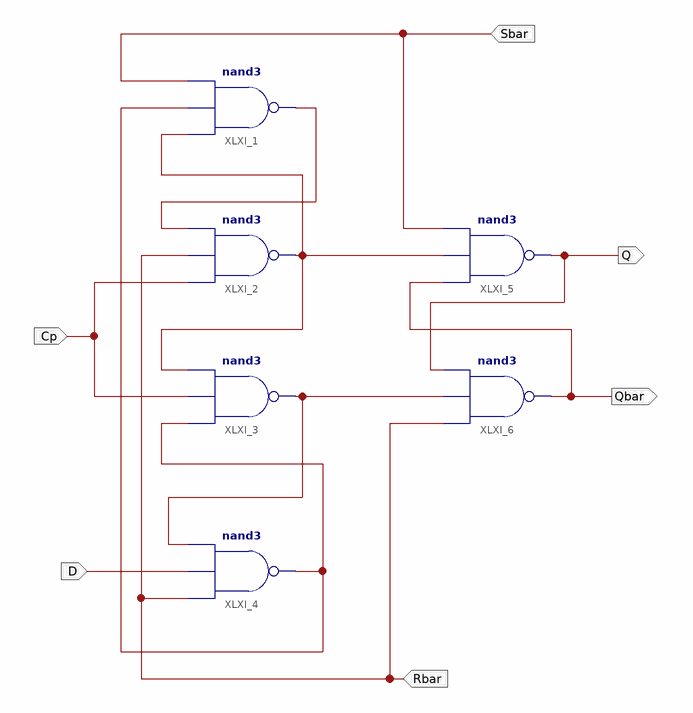
[diagram p0: schematic sheet 1]
// Xilinx ISE schematic D_FLIPFLOP.sch (kintex7) as structural Verilog: 6 symbols, 6 ports
module D_FLIPFLOP (
  input  Sbar,
  input  Rbar,
  input  Cp,
  input  D,
  output Q,
  output Qbar
);

  wire XLXN_2, XLXN_3, XLXN_4, XLXN_7;

  nand XLXI_1 (XLXN_4, XLXN_2, XLXN_7, Sbar);
  nand XLXI_2 (XLXN_2, Cp, Rbar, XLXN_4);
  nand XLXI_3 (XLXN_3, XLXN_7, Cp, XLXN_2);
  nand XLXI_4 (XLXN_7, Rbar, D, XLXN_3);
  nand XLXI_5 (Q, Qbar, XLXN_2, Sbar);
  nand XLXI_6 (Qbar, Rbar, XLXN_3, Q);
endmodule
